# Altium schematic sheet RemoteController.SchDoc
size A4
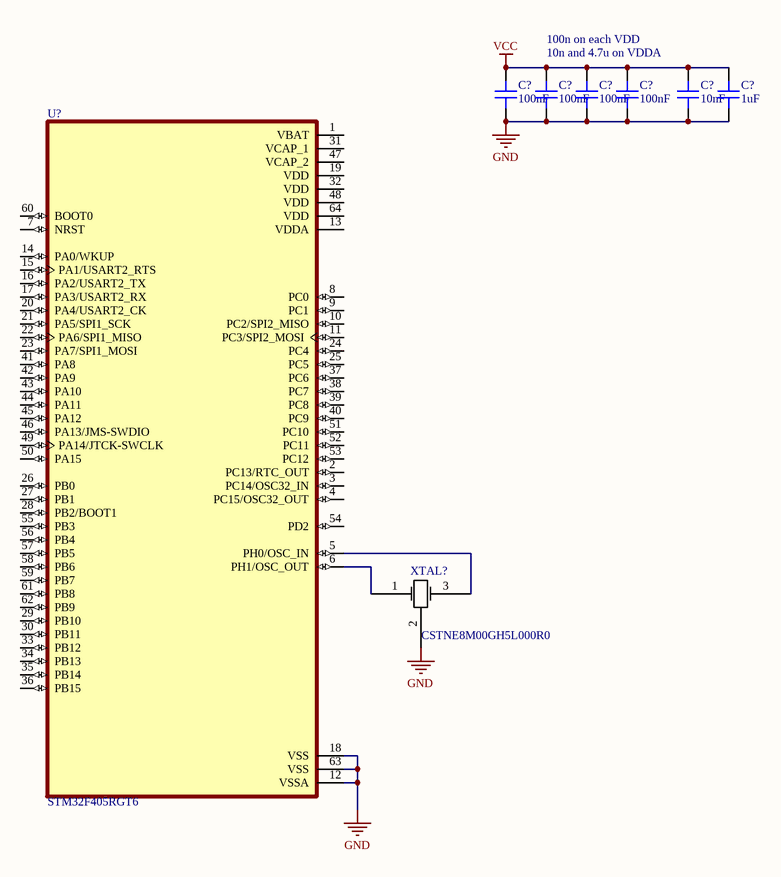
[diagram p0: RemoteController.SchDoc]

## Parts
(Parts that share a designator on the sheet are numbered #1, #2 ... from top to bottom, then left to right.)
C?#1  100nF  [CAP 0402_1005]
C?#2  100nF  [CAP 0402_1005]
C?#3  100nF  [CAP 0402_1005]
C?#4  100nF  [CAP 0402_1005]
C?#5  10nF  [CAP 0402_1005]
C?#6  1uF  [CAP 0402_1005]
U?  STM32F405RGT6  [QFP50P1200X1200X160-64N]
XTAL?  CSTNE8M00GH5L000R0  [CSTNE8M00GH5L000]

## Nets
GND: C?#1.1 C?#2.1 C?#3.1 C?#4.1 C?#5.1 C?#6.1 U?.12(VSSA) U?.18(VSS) U?.63(VSS) XTAL?.2(GND)
VCC: C?#1.2 C?#2.2 C?#3.2 C?#4.2 C?#5.2 C?#6.2
NetU?_5: U?.5(PH0/OSC_IN) XTAL?.3(OUTPUT)
NetU?_6: U?.6(PH1/OSC_OUT) XTAL?.1(INPUT)

Not connected (* = marked no-connect by the designer): U? 1(VBAT) 2(PC13/RTC_OUT) 3(PC14/OSC32_IN) 4(PC15/OSC32_OUT) 7(NRST) 8(PC0) 9(PC1) 10(PC2/SPI2_MISO) 11(PC3/SPI2_MOSI) 13(VDDA) 14(PA0/WKUP) 15(PA1/USART2_RTS) 16(PA2/USART2_TX) 17(PA3/USART2_RX) 19(VDD) 20(PA4/USART2_CK) 21(PA5/SPI1_SCK) 22(PA6/SPI1_MISO) 23(PA7/SPI1_MOSI) 24(PC4) 25(PC5) 26(PB0) 27(PB1) 28(PB2/BOOT1) 29(PB10) 30(PB11) 31(VCAP_1) 32(VDD) 33(PB12) 34(PB13) 35(PB14) 36(PB15) 37(PC6) 38(PC7) 39(PC8) 40(PC9) 41(PA8) 42(PA9) 43(PA10) 44(PA11) 45(PA12) 46(PA13/JMS-SWDIO) 47(VCAP_2) 48(VDD) 49(PA14/JTCK-SWCLK) 50(PA15) 51(PC10) 52(PC11) 53(PC12) 54(PD2) 55(PB3) 56(PB4) 57(PB5) 58(PB6) 59(PB7) 60(BOOT0) 61(PB8) 62(PB9) 64(VDD)

## Notes on the sheet
- (near C?#2) 100n on each VDD
- (near C?#2) 10n and 4.7u on VDDA

## Library data of the parts
C?#1-C?#6 = C0402C104M4VACTU: CAP CER 0.1UF 16V Y5V 0402; Manufacturer: KEMET; Capacitance: 0.1µF; Temperature Coefficient: Y5V (F); Tolerance: ±20%; Part Number: C0402C104M4VACTU; Applications: General Purpose; ComponentLink1Description: Datasheet; ComponentLink1URL: //media.digikey.com/PDF/Data%20Sheets/Kemet%20PDFs/COG%20Dielectric.pdf; ComponentLink2Description: DigiKey Link; ComponentLink2URL: http://digikey.com/product-detail/en/kemet/C0402C104M4VACTU/399-7332-1-ND/3316949; Device Package: 0402 (1005 Metric); LastUpdated: 4/1/2020 11:57:05 PM; Lifecycle Status: Active; Minimum Order: 1; Mounting Type: Surface Mount, MLCC; Operating Temperature: -30°C ~ 85°C; Package / Case: 0402 (1005 Metric); Packaging: TapeAndReel; PartId: 1738; Part Status: Active; Price: 0.08; Series: SMD Comm Y5V; Size / Dimension: 0.039" L x 0.020" W (1.00mm x 0.50mm); Supplier 1: DigiKey; Supplier Part Number 1: 399-7332-1-ND; Thickness (Max): 0.022" (0.55mm); Voltage - Rated: 16V
  C?#1-C?#4: Value: 100nF
  C?#5: Value: 10nF
  C?#6: Value: 1uF
U? = STM32F405RGT6: ARMÂ® CortexÂ®-M4 STM32F4 Microcontroller IC 32-Bit 168MHz 1MB _1M x 8_ FLASH 64-LQFP _10x10_; MF: STMicroelectronics; Package: LQFP-64 STMicroelectronics; Digi-Key_Purchase_URL: https://www.digikey.com/product-detail/en/stmicroelectronics/STM32F405RGT6/497-11767-ND/2754208?utm_source=snapeda&utm_medium=aggregator&utm_campaign=symbol; Value: *; MP: STM32F405RGT6; SnapEDA_Link: https://www.snapeda.com/parts/STM32F405RGT6/STMicroelectronics/view-part/105502/?ref=snap; Digi-Key_Part_Number: 497-11767-ND
XTAL? = CSTNE8M00GH5L000: No Description Available; Vendor: Murata; Built_By: EMA_Cory; SourceLibrary: Murata_2020-02-28; Datasheet: https://www.murata.com/en/products/productdata/8801161805854/SPEC-CSTNE8M00GH5L000R0.pdf; Manufacturer_Part_Number: CSTNE8M00GH5L000R0; Copyright: Copyright (C) 2018 Accelerated Designs. All rights reserved; RefDes: RefDes; Type: DEV